# Altium schematic sheet Projeto Final.SchDoc
size A4
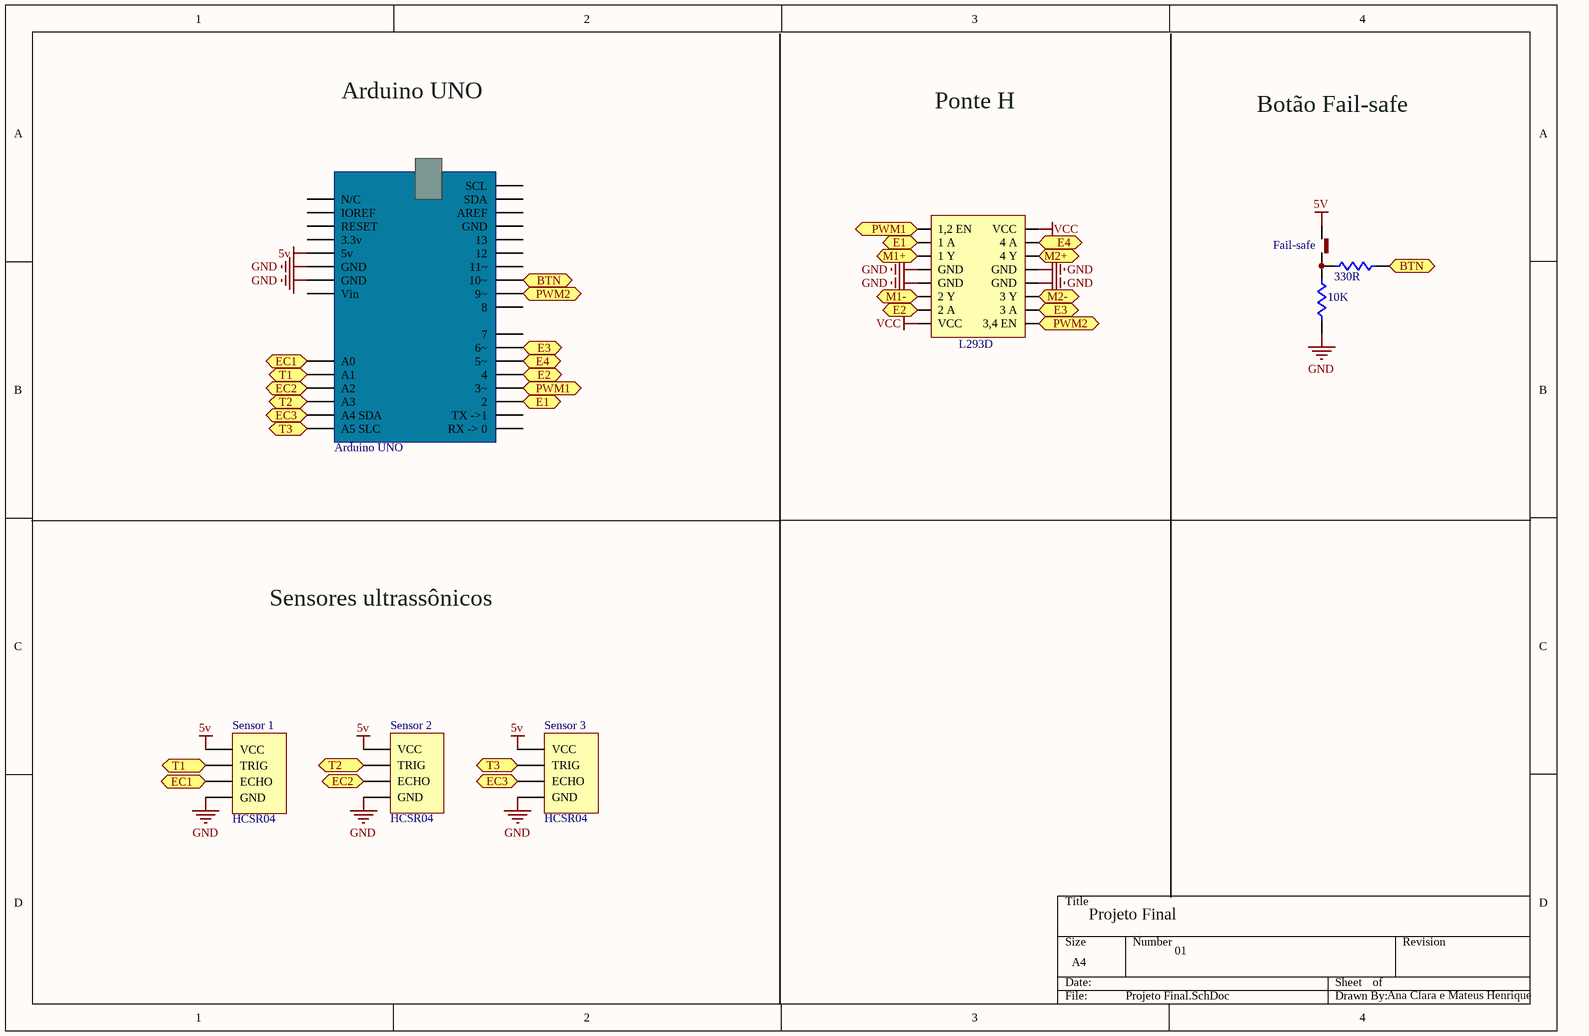
[diagram p0: Projeto Final.SchDoc]

## Parts
10K  Resistor 1/8W  [Resistor 1/8W]  (value not drawn)
330R  Resistor 1/8W  [Resistor 1/8W]  (value not drawn)
Fail-safe  Botao  [Botão smd]  (value not drawn)
L293D  L293D  (value not drawn)
Sensor_1  HCSR04
Sensor_2  HCSR04
Sensor_3  HCSR04
U1  Arduino UNO

## Ports
BTN, E1 (bidir), E2 (bidir), E3 (bidir), E4 (bidir), EC1, EC1 (bidir), EC2, EC2 (bidir), EC3 (bidir), M1+ (bidir), M1- (bidir), M2+ (bidir), M2- (bidir), PWM1 (bidir), PWM2 (bidir), T1 (bidir), T2 (bidir), T3 (bidir)

## Nets
5v: Fail-safe.1 Sensor_1.1(VCC) Sensor_2.1(VCC) Sensor_3.1(VCC) U1.5(5v)
GND: 10K.1 L293D.4(GND) L293D.5(GND) L293D.12(GND) L293D.13(GND) Sensor_1.4(GND) Sensor_2.4(GND) Sensor_3.4(GND) U1.6(GND) U1.7(GND)
VCC: L293D.8(VCC) L293D.16(VCC)
BTN: 330R.1 U1.22(10~) ; port BTN
E1: L293D.2(1_A) U1.30(2) ; port E1
E2: L293D.7(2_A) U1.28(4) ; port E2
E3: L293D.10(3_A) U1.26(6~) ; port E3
E4: L293D.15(4_A) U1.27(5~) ; port E4
EC1: Sensor_1.3(ECHO) U1.9(A0) ; port EC1
EC2: Sensor_2.3(ECHO) U1.11(A2) ; port EC2
EC3: Sensor_3.3(ECHO) U1.13(A4_SDA) ; port EC3
M1+: L293D.3(1_Y) ; port M1+
M1-: L293D.6(2_Y) ; port M1-
M2+: L293D.14(4_Y) ; port M2+
M2-: L293D.11(3_Y) ; port M2-
PWM1: L293D.1(1,2_EN) U1.29(3~) ; port PWM1
PWM2: L293D.9(3,4_EN) U1.23(9~) ; port PWM2
T1: Sensor_1.2(TRIG) U1.10(A1) ; port T1
T2: Sensor_2.2(TRIG) U1.12(A3) ; port T2
T3: Sensor_3.2(TRIG) U1.14(A5_SLC) ; port T3
Net10K_2: 10K.2 330R.2 Fail-safe.2

Not connected (* = marked no-connect by the designer): U1 1(N/C) 2(IOREF) 3(RESET) 4(3.3v) 8(Vin) 15(SCL) 16(SDA) 17(AREF) 18(GND) 19(13) 20(12) 21(11~) 24(8) 25(7) 31(TX_->1) 32(RX_->_0)

## Notes on the sheet
- Arduino UNO
- Ponte H
- Botão Fail-safe
- Sensores ultrassônicos
- Projeto Final
- 01
- Ana Clara e Mateus Henrique

## Library data of the parts
10K 330R = Resistor 1/8W: Resistor
Fail-safe = Botao: Botão
Sensor_1-Sensor_3 = HCSR04 outro: Sensor Ultrassônico